# EAGLE design RJ45 Breakout (EAGLE 9.4.2)
RJ45 Breakout to Data + Power
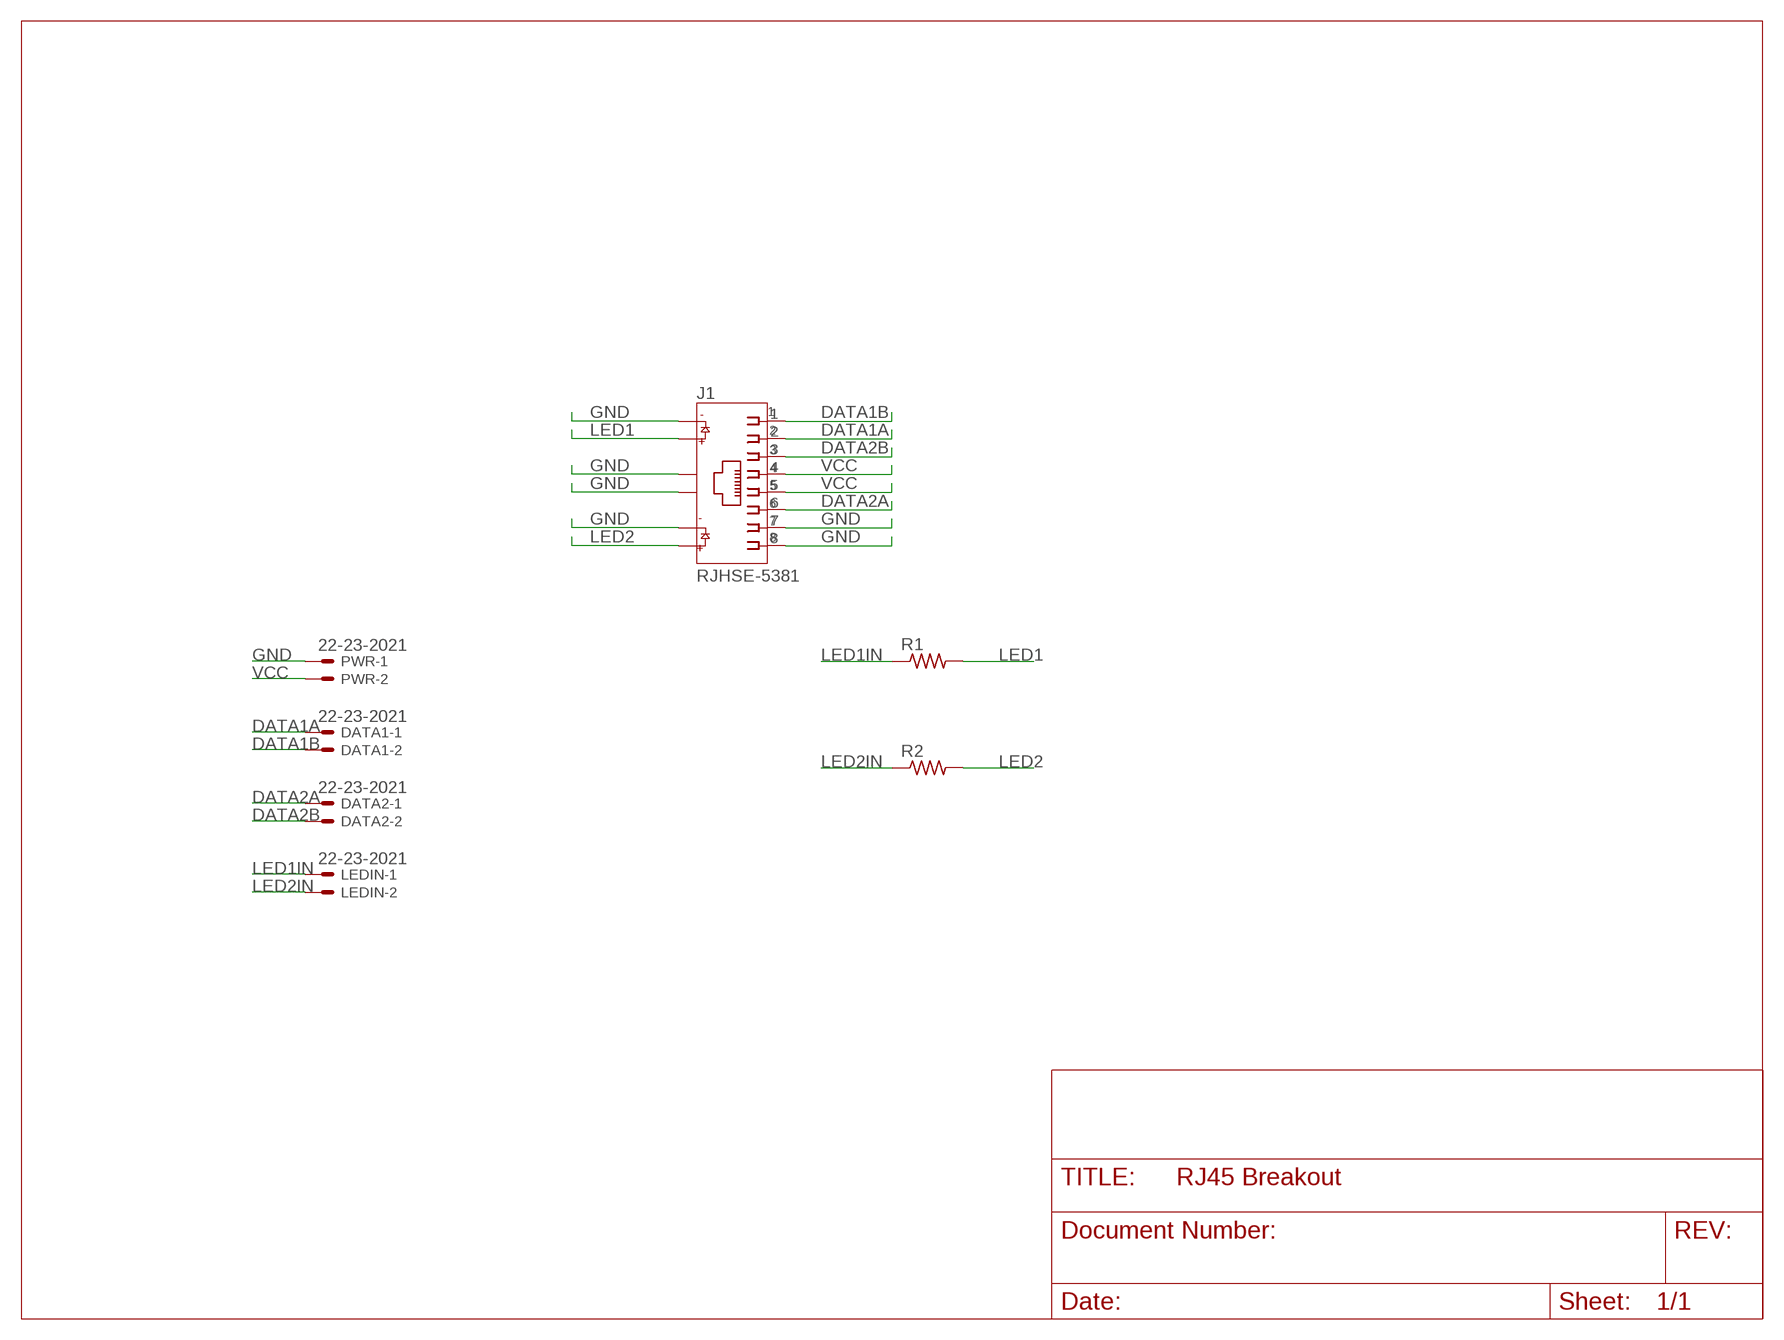
[diagram p0: schematic, sheet 1]

## Parts
DATA1  22-23-2021  [22-23-2021]
DATA2  22-23-2021  [22-23-2021]
J1  RJHSE-5381  [AMPHENOL_RJHSE-5381]
LEDIN  22-23-2021  [22-23-2021]
PWR  22-23-2021  [22-23-2021]
R1  R-US_0207/10  [0207/10]
R2  R-US_0207/10  [0207/10]

## Nets
DATA1A: DATA1.1 J1.2
DATA1B: DATA1.2 J1.1
DATA2A: DATA2.1 J1.6
DATA2B: DATA2.2 J1.3
GND: J1.7 J1.8 J1.9 J1.11 J1.S1 J1.S2 PWR.1
LED1: J1.10 R1.2
LED1IN: LEDIN.1 R1.1
LED2: J1.12 R2.2
LED2IN: LEDIN.2 R2.1
VCC: J1.4 J1.5 PWR.2

## Library data of the parts
DATA1 DATA2 LEDIN PWR = con-molex:22-23-2021: .100" (2.54mm) Center Header - 2 Pin; MF: MOLEX; MPN: 22-23-2021; OC_FARNELL: 1462926; OC_NEWARK: 25C3832
J1 = RJHSE-5381:RJHSE-5381: connector, mod jack, rt angle pcb, shielded, led1-g, led2-y, single port, rj-45 8 cont; AVAILABILITY: Unavailable; DESCRIPTION: connector, mod jack, rt angle pcb, shielded, led1-g, led2-y, single port, rj-45 8 cont; MF: Amphenol ICC; MP: RJHSE-5381; PACKAGE: None; PRICE: None
R1 R2 = rcl:R-US_: RESISTOR, American symbol; SPICEPREFIX: R

## Board
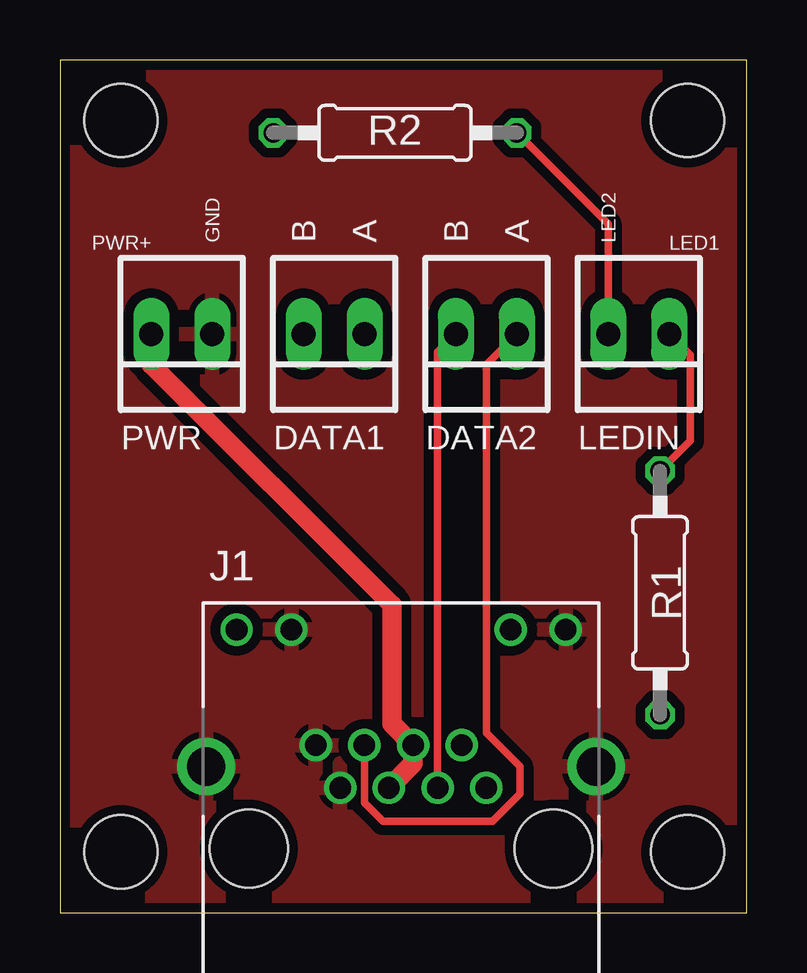
[diagram p1: board, top side]
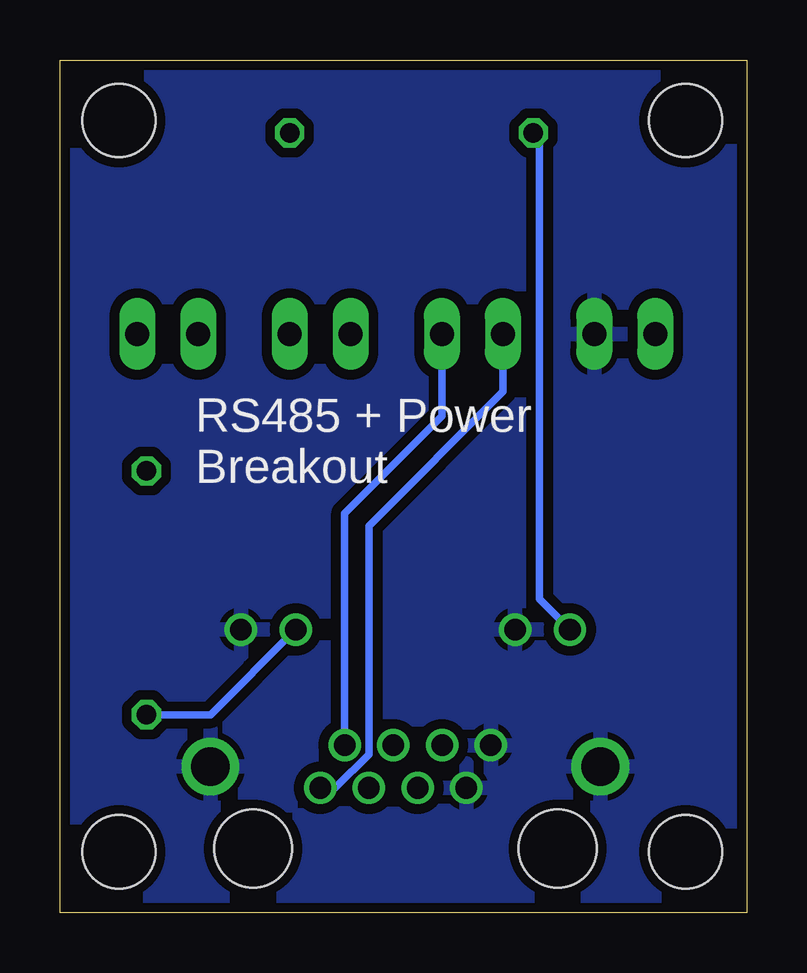
[diagram p2: board, bottom side, seen from below]

Size 28.63 x 35.55 mm. Coordinates in mm from the lower left corner, seen from the top.
Outline: 0,0 28.63,0 28.63,35.55 0,35.55 0,0
Copper layers (1*16): Top 0.035559375mm / dielectric 1.6mm / Bottom 0.035559375mm
Design rules "oshpark-2layer": minimum track width 6mil, minimum drill 10mil, track to track 6mil, track to pad 6mil, pad to pad 6mil, via to via 6mil, smd to smd 6mil, copper to edge 15mil, drill to drill 6mil, minimum pad ring 5mil, minimum via ring 5mil, stop-mask expansion 2.5mil, vias tented up to drill 0mil, thermal gap 10mil
Holes 3.05 mm at 2.54,2.54 26.16,2.54 26.16,33.02 2.54,33.02

### Footprints (pad centres in the part's own frame; a part is rotated, then mirrored left to right if it is on the bottom)
22-23-2021 = drill 1 long: 1 -1.27,0; 2 1.27,0
AMPHENOL_RJHSE-5381 = drill 0.9: 1 3.55,2.54; 2 2.53,4.32; 3 1.52,2.54; 4 0.5,4.32; 5 -0.51,2.54; 6 -1.53,4.32; 7 -2.54,2.54; 8 -3.56,4.32; 9 6.86,9.14; 10 4.57,9.14; 11 -4.57,9.14; 12 -6.86,9.14 | drill 1.6: S1 8.13,3.43; S2 -8.13,3.43 | hole 3.25: 6.35,0; -6.35,0
0207/10 = drill 0.813 octagon: 1 -5.08,0; 2 5.08,0

### Placement (x,y rotation side)
DATA1  11.43,24.13 180 top
DATA2  17.78,24.13 180 top
J1  14.22,2.67 0 top
LEDIN  24.13,24.13 180 top
PWR  5.08,24.13 180 top
R1  25.02,13.34 270 top
R2  13.97,32.51 180 top

### Tracks (layer width: path | path; a pad name or v marks a point on that pad's centre or on a via)
DATA1A
  Bottom 0.305: DATA1.1 12.7,20.7 16.75,16.65 J1.2
DATA1B
  Bottom 0.305: DATA1.2 10.16,21.72 15.75,16.13 15.75,6.61 17.15,5.21 J1.1
DATA2A
  Top 0.305: DATA2.1 17.78,22.86 17.78,7.49 19.18,6.1 19.18,4.95 18.03,3.81 13.46,3.81 12.69,4.58 J1.6
DATA2B
  Top 0.305: J1.3 15.74,23.36 DATA2.2
GND
  pour Bottom (isolate 0.406): 0,35.56 29.21,35.56 29.21,8.89 30.48,7.62 30.48,0 0,0
  pour Top (isolate 0.406): 0,35.56 29.21,35.56 29.21,0 0,0
LED1
  Bottom 0.305: R1.2 22.35,8.26 J1.10
LED1IN
  Top 0.305: LEDIN.1 26.29,23.24 26.29,19.68 R1.1
LED2
  Bottom 0.305: J1.12 8.63,13.08 8.63,32.26 R2.2
LED2IN
  Top 0.305: R2.1 22.86,28.7 LEDIN.2
VCC
  Top 0.813: PWR.2 3.81,22.86 13.84,12.83 13.84,7.87 J1.4 14.72,6.22 J1.5

### Text on the board
tNames: PWR+ | GND | B | A | B | A | LED2 | LED1
bNames: RS485 + Power / Breakout